# Altium schematic sheet [05] RADIO.SchDoc: Template
size A4; Author: Hom; CompanyName: KitSprout; DrawnBy: Hom; Engineer: Hom; Organization: KitSprout; Revision: A; SheetNumber: 5; SheetTotal: 7; Version: 0.0; LibVersion: 0.0
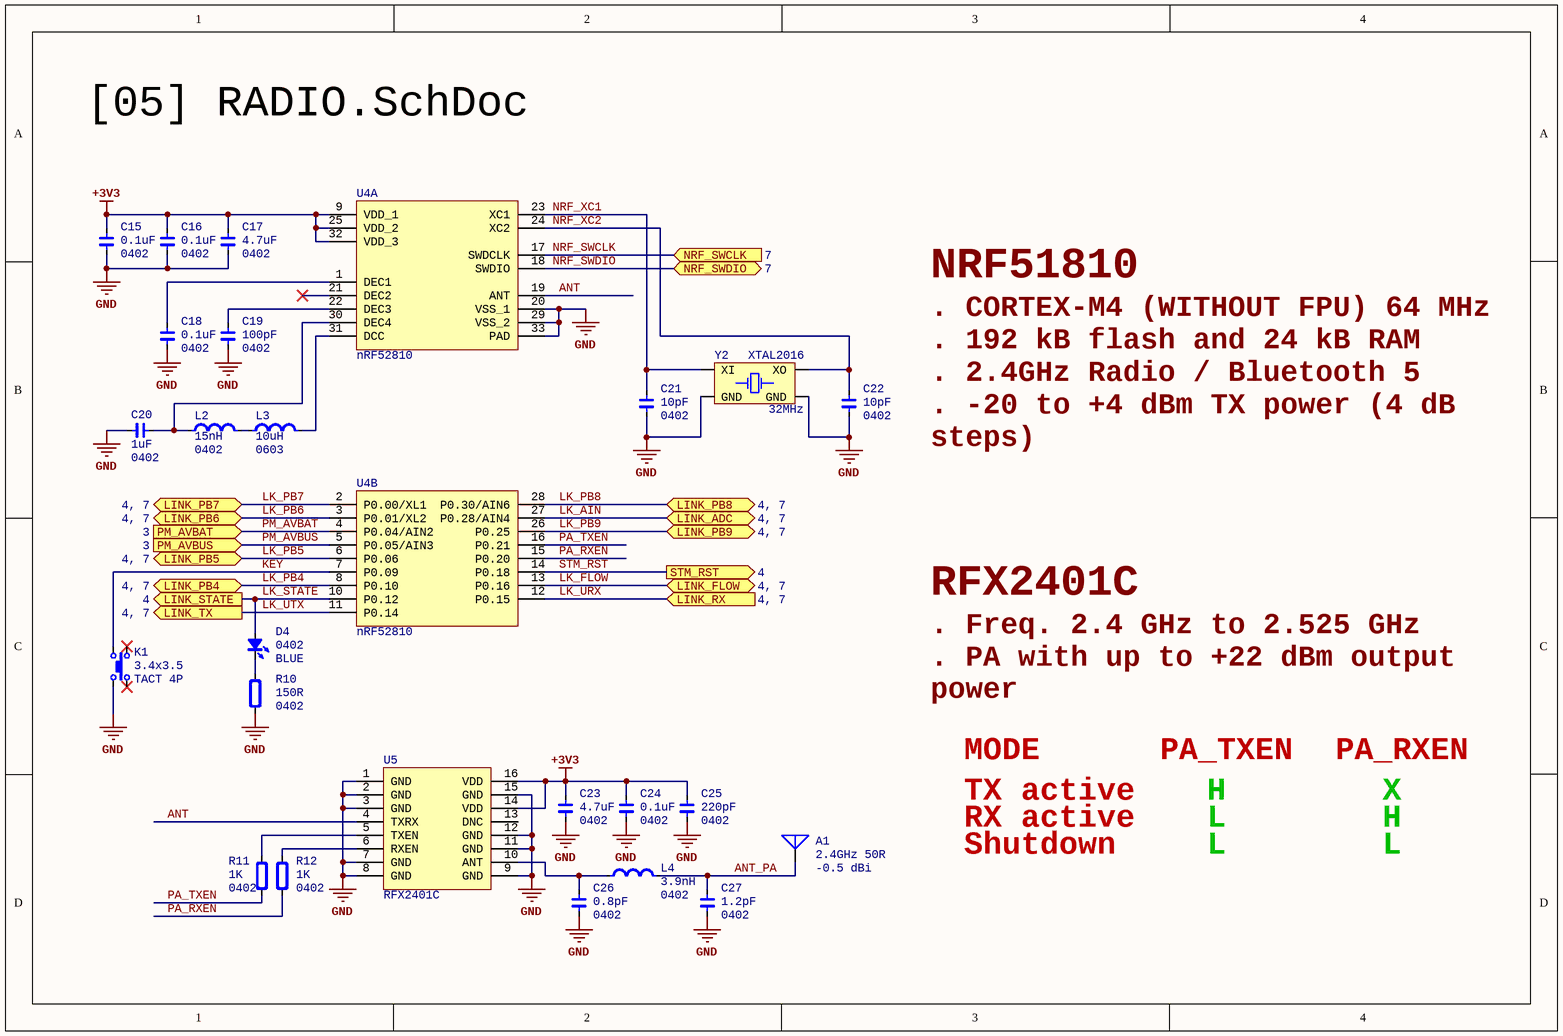
[diagram p0: [05] RADIO.SchDoc]

## Parts
A1  2.4GHz 50R  value -0.5 dBi  [ANT_2.4G_3.2x1.6]
C15  value 0.1uF  Type: 0402  [CAP_0402]  (hidden comment: C0402)
C16  value 0.1uF  Type: 0402  [CAP_0402]  (hidden comment: C0402)
C17  value 4.7uF  Type: 0402  [CAP_0402]  (hidden comment: C0402)
C18  value 0.1uF  Type: 0402  [CAP_0402]  (hidden comment: C0402)
C19  value 100pF  Type: 0402  [CAP_0402]  (hidden comment: C0402)
C20  value 1uF  Type: 0402  [CAP_0402]  (hidden comment: C0402)
C21  value 10pF  Type: 0402  [CAP_0402]  (hidden comment: C0402)
C22  value 10pF  Type: 0402  [CAP_0402]  (hidden comment: C0402)
C23  value 4.7uF  Type: 0402  [CAP_0402]  (hidden comment: C0402)
C24  value 0.1uF  Type: 0402  [CAP_0402]  (hidden comment: C0402)
C25  value 220pF  Type: 0402  [CAP_0402]  (hidden comment: C0402)
C26  value 0.8pF  Type: 0402  [CAP_0402]  (hidden comment: C0402)
C27  value 1.2pF  Type: 0402  [CAP_0402]  (hidden comment: C0402)
D4  Type: 0402  [LED_0402_BLUE]  (hidden comment: BLUE)
K1  value 3.4x3.5  [ButtonTACT_3.4*3.5_90]  (hidden comment: TACT 4P)
L2  value 15nH  Type: 0402  [IND_0402]  (hidden comment: H0402)
L3  value 10uH  Type: 0603  [IND_0603]  (hidden comment: H0603)
L4  value 3.9nH  Type: 0402  [IND_0402]  (hidden comment: H0402)
R10  value 150R  Type: 0402  [RES_0402]  (hidden comment: R0402)
R11  value 1K  Type: 0402  [RES_0402]  (hidden comment: R0402)
R12  value 1K  Type: 0402  [RES_0402]  (hidden comment: R0402)
U4  nRF52810  [QFN_P0.5_32]  (parts A,B of 2)
U5  RFX2401C  [QFN_P0.5_16]
Y2  value 32MHz  [XT_2016_4]  (hidden comment: XTAL2016)

## Ports
LINK_ADC (bidir, see 4, 7), LINK_FLOW (bidir, see 4, 7), LINK_PB4 (bidir, see 4, 7), LINK_PB5 (bidir, see 4, 7), LINK_PB6 (bidir, see 4, 7), LINK_PB7 (bidir, see 4, 7), LINK_PB8 (bidir, see 4, 7), LINK_PB9 (bidir, see 4, 7), LINK_RX (in, see 4, 7), LINK_STATE (out, see 4), LINK_TX (out, see 4, 7), NRF_SWCLK (in, see 7), NRF_SWDIO (bidir, see 7), PM_AVBAT (in, see 3), PM_AVBUS (in, see 3), STM_RST (out, see 4)

## Nets
+3V3: C15.2 C16.2 C17.2 C23.2 C24.2 C25.2 U4.9(VDD_1) U4.25(VDD_2) U4.32(VDD_3) U5.14(VDD) U5.16(VDD)
GND: C15.1 C16.1 C17.1 C18.1 C19.1 C20.2 C21.1 C22.1 C23.1 C24.1 C25.1 C26.1 C27.1 K1.1 R10.1 U4.20(VSS_1) U4.29(VSS_2) U4.33(PAD) U5.1(GND) U5.2(GND) U5.3(GND) U5.7(GND) U5.8(GND) U5.9(GND) U5.11(GND) U5.12(GND) U5.15(GND) Y2.2(GND) Y2.4(GND)
ANT: U4.19(ANT) U5.4(TXRX)
ANT_PA: A1.1(A) C27.2 L4.2
KEY: K1.2 U4.7(P0.09)
LK_AIN: U4.27(P0.28/AIN4) ; port LINK_ADC
LK_FLOW: U4.13(P0.16) ; port LINK_FLOW
LK_PB4: U4.8(P0.10) ; port LINK_PB4
LK_PB5: U4.6(P0.06) ; port LINK_PB5
LK_PB6: U4.3(P0.01/XL2) ; port LINK_PB6
LK_PB7: U4.2(P0.00/XL1) ; port LINK_PB7
LK_PB8: U4.28(P0.30/AIN6) ; port LINK_PB8
LK_PB9: U4.26(P0.25) ; port LINK_PB9
LK_STATE: D4.1(A) U4.10(P0.12) ; port LINK_STATE
LK_URX: U4.12(P0.15) ; port LINK_RX
LK_UTX: U4.11(P0.14) ; port LINK_TX
NRF_SWCLK: U4.17(SWDCLK) ; port NRF_SWCLK
NRF_SWDIO: U4.18(SWDIO) ; port NRF_SWDIO
NRF_XC1: C21.2 U4.23(XC1) Y2.1(XI)
NRF_XC2: C22.2 U4.24(XC2) Y2.3(XO)
PA_RXEN: R12.1 U4.15(P0.20)
PA_TXEN: R11.1 U4.16(P0.21)
PM_AVBAT: U4.4(P0.04/AIN2) ; port PM_AVBAT
PM_AVBUS: U4.5(P0.05/AIN3) ; port PM_AVBUS
STM_RST: U4.14(P0.18) ; port STM_RST
NetC18_2: C18.2 U4.1(DEC1)
NetC19_2: C19.2 U4.22(DEC3)
NetC20_1: C20.1 L2.1 U4.30(DEC4)
NetC26_2: C26.2 L4.1 U5.10(ANT)
NetD4_2: D4.2(K) R10.2
NetL2_2: L2.2 L3.1
NetL3_2: L3.2 U4.31(DCC)
NetR11_2: R11.2 U5.5(TXEN)
NetR12_2: R12.2 U5.6(RXEN)

Not connected (* = marked no-connect by the designer): K1 3* 4*; U4 21(DEC2)*; U5 13(DNC)

## Notes on the sheet
- NRF51810
- . CORTEX-M4 (WITHOUT FPU) 64 MHz
  . 192 kB flash and 24 kB RAM
  . 2.4GHz Radio / Bluetooth 5
  . -20 to +4 dBm TX power (4 dB steps)
  . -96 dBm sensitivity
- RFX2401C
- . Freq. 2.4 GHz to 2.525 GHz
  . PA with up to +22 dBm output power
  . LNA with 2.5 dB noise figure
- MODE
- PA_TXEN
- PA_RXEN
- TX active
- RX active
- H
- L
- X
- Shutdown

## Library data of the parts
A1 = Ant_2.4G: Antenna; type: 3.2x1.6
C15-C27 = Cap_0402: Capacitor; Specification: X7R 50V; Manufacturer: *
D4 = LED_0402: LED; Value: BLUE
K1 = ButtonTACT: Button; type: TACT 4P
L2 L4 = Ind_0402: Inductor; Specification: ±5% 100mA; Manufacturer: *
L3 = Ind_0603: Inductor; Specification: ±5% 100mA; Manufacturer: *
R10-R12 = Res_0402: Resistor; Specification: ±5%; Manufacturer: *
U4 = nRF52810: MCU; Value: 64MHz; Type: QFN32 P0.5
U5 = RFX2401C: Radio PA/LNA; Type: QFN16 P0.5
Y2 = XTAL_2016_4P: Crystal Oscillator; Type: XTAL2016